# Altium schematic sheet MCU.SchDoc
size A; SheetNumber: 5; SheetTotal: 11
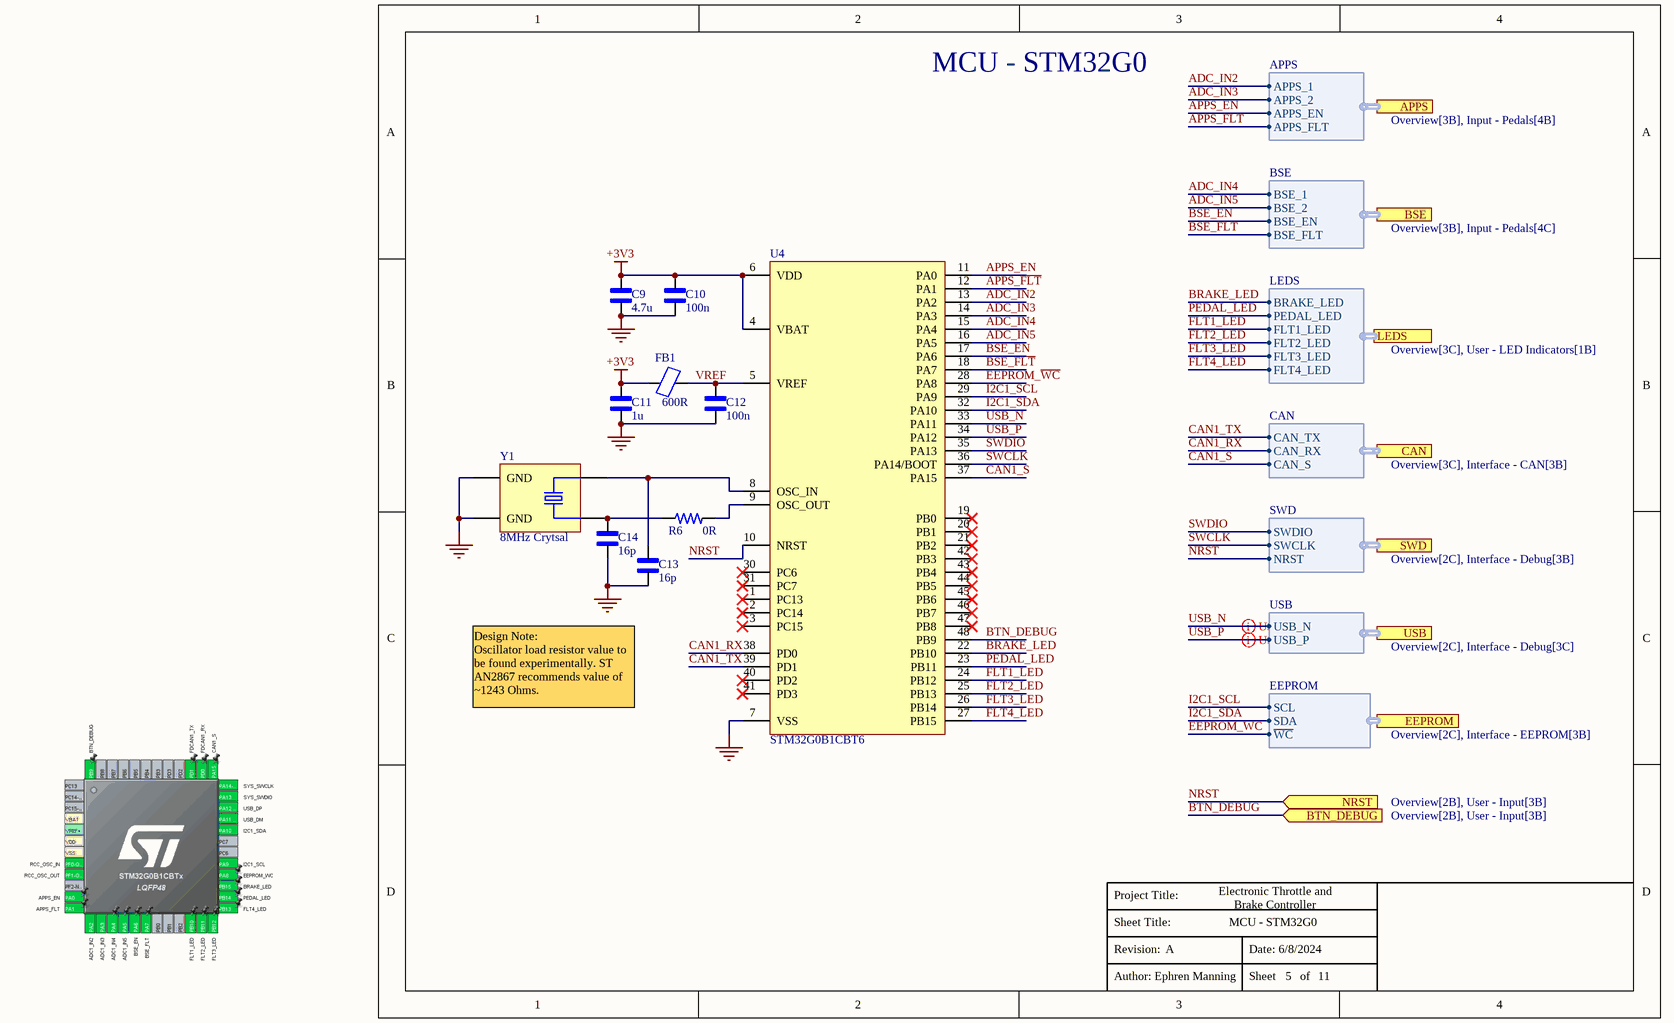
[diagram p0: MCU.SchDoc]

## Parts
C9  4.7u  [CAP_0402-Footprint-1]
C10  100n  [CAP_0402-Footprint-1]
C11  1u  [CAP_0402-Footprint-1]
C12  100n  [CAP_0402-Footprint-1]
C13  16p  [CAP_0402-Footprint-1]
C14  16p  [CAP_0402-Footprint-1]
FB1  600R  [FB_0402-Footprint-1]
R6  0R  [RES_0402-Footprint-1]
U4  STM32G0B1CBT6  [STM32G0-LQFP48]
Y1  ECS-80-18-33-JGN-TR  [XTAL_ECS-240-8-33-AGN-TR]  (value not drawn)

## Ports
APPS (harness APPS, see Overview[3B], Input - Pedals[4B]), BSE (harness BSE, see Overview[3B], Input - Pedals[4C]), BTN_DEBUG (in, see Overview[2B], User - Input[3B]), CAN (harness CAN, see Overview[3C], Interface - CAN[3B]), EEPROM (harness EEPROM, see Overview[2C], Interface - EEPROM[3B]), LEDS (harness LEDS, see Overview[3C], User - LED Indicators[1B]), NRST (in, see Overview[2B], User - Input[3B]), SWD (harness SWD, see Overview[2C], Interface - Debug[3B]), USB (harness USB, see Overview[2C], Interface - Debug[3C])

## Harnesses
CAN: CAN_TX, CAN_RX, CAN_S
SWD: SWDIO, SWCLK, NRST
USB: USB_N, USB_P
LEDS: BRAKE_LED, PEDAL_LED, FLT1_LED, FLT2_LED, FLT3_LED, FLT4_LED
EEPROM: SCL, SDA, ~{WC}
APPS: APPS_1, APPS_2, APPS_EN, APPS_FLT
BSE: BSE_1, BSE_2, BSE_EN, BSE_FLT

## Nets
+3V3: C9.2 C10.2 C11.2 FB1.1 U4.4(VBAT) U4.6(VDD)
GND: C9.1 C10.1 C11.1 C12.1 C13.2 C14.1 U4.7(VSS) Y1.2(GND) Y1.4(GND)
ADC_IN2: U4.13(PA2) ; port APPS.APPS_1
ADC_IN3: U4.14(PA3) ; port APPS.APPS_2
ADC_IN4: U4.15(PA4) ; port BSE.BSE_1
ADC_IN5: U4.16(PA5) ; port BSE.BSE_2
APPS_EN: U4.11(PA0) ; port APPS.APPS_EN
APPS_~{FLT}: U4.12(PA1) ; port APPS.APPS_FLT
BRAKE_LED: U4.22(PB10) ; port LEDS.BRAKE_LED
BSE_EN: U4.17(PA6) ; port BSE.BSE_EN
BSE_~{FLT}: U4.18(PA7) ; port BSE.BSE_FLT
BTN_DEBUG: U4.48(PB9) ; port BTN_DEBUG
CAN1_RX: U4.38(PD0) ; port CAN.CAN_RX
CAN1_S: U4.37(PA15) ; port CAN.CAN_S
CAN1_TX: U4.39(PD1) ; port CAN.CAN_TX
EEPROM_~{WC}: U4.28(PA8) ; port EEPROM.~{WC}
FLT1_LED: U4.24(PB12) ; port LEDS.FLT1_LED
FLT2_LED: U4.25(PB13) ; port LEDS.FLT2_LED
FLT3_LED: U4.26(PB14) ; port LEDS.FLT3_LED
FLT4_LED: U4.27(PB15) ; port LEDS.FLT4_LED
I2C1_SCL: U4.29(PA9) ; port EEPROM.SCL
I2C1_SDA: U4.32(PA10) ; port EEPROM.SDA
NRST: U4.10(NRST) ; port NRST, port SWD.NRST
PEDAL_LED: U4.23(PB11) ; port LEDS.PEDAL_LED
SWCLK: U4.36(PA14/BOOT) ; port SWD.SWCLK
SWDIO: U4.35(PA13) ; port SWD.SWDIO
USB_N: U4.33(PA11) ; port USB.USB_N
USB_P: U4.34(PA12) ; port USB.USB_P
VREF: C12.2 FB1.2 U4.5(VREF)
NetC13_1: C13.1 U4.8(OSC_IN) Y1.1(IN/OUT)
NetC14_2: C14.2 R6.1 Y1.3(OUT/IN)
NetR6_2: R6.2 U4.9(OSC_OUT)

Not connected (* = marked no-connect by the designer): U4 1(PC13)* 2(PC14)* 3(PC15)* 19(PB0)* 20(PB1)* 21(PB2)* 30(PC6)* 31(PC7)* 40(PD2)* 41(PD3)* 42(PB3)* 43(PB4)* 44(PB5)* 45(PB6)* 46(PB7)* 47(PB8)*

## Layout directives
differential pair: USB_N, USB_P

## Notes on the sheet
- MCU - STM32G0
- (near Y1) 8MHz Crytsal
- Design Note:
  Oscillator load resistor value to be found experimentally. ST AN2867 recommends value of ~1243 Ohms.
- Electronic Throttle and
  Brake Controller
- A
- 6/8/2024
- Ephren Manning
- 5
- 11
- Project Title:
- Sheet Title:
- Revision:
- Date:
- Author:
- Sheet        of

## Library data of the parts
C9 = CMP-00067-3: 4.7uF 10V 20% 0402 CAP; Manufacturer Part Number 1: CL05A475MP5NRNC; Manufacturer 1: Samsung Electro-Mechanics; Digikey Part Number: 1276-1482-1-ND
C10 C12 = CMP-00066-3: 100nF 10V 10% 0402 CAP; Manufacturer 1: Samsung Electro-Mechanics; Manufacturer Part Number 1: CL05B104KP5NNNC; Digikey Part Number: 1276-1002-1-ND
C11 = CMP-00068-3: 1uF 10V 10% 0402 CAP; Manufacturer Part Number 1: CL05A105KP5NNNC; Manufacturer 1: Samsung Electro-Mechanics; Digikey Part Number: 1276-1076-1-ND
C13 C14 = CMP-00065-1: 16pF 50V 1% 0402 Ceramic Capacitor; Manufacturer Part Number 1: GJM1555C1H160FB01J; Manufacturer 1: Murata Electronics; Digikey Part Number: 490-GJM1555C1H160FB01JCT-ND
FB1 = CMP-00069-1: 600R@100MHz 300mA 0402 Ferrite Bead; Manufacturer 1: Murata Electronics; Manufacturer Part Number 1: BLM15AG601SN1D; Digikey Part Number: 490-1006-1-ND
R6 = CMP-00070-1: 0 Ohm 1/16W 0402 Resistor; Manufacturer 1: YAGEO; Manufacturer Part Number 1: RC0402JR-070RL; Digikey Part Number: 311-0.0JRCT-ND
U4 = CMP-00062-7: 32-bit Cortex-M0+ MCU 48LQFP; Manufacturer 1: STMicroelectronics; Digikey Part Number: 497-STM32G0B1CBT6-ND; Manufacturer Part Number 1: STM32G0B1CBT6
Y1 = CMP-128-000000-3: 8MHz ±20ppm 18pF Crystal; Manufacturer 1: ECS Inc.; Digikey Part Number: 50-ECS-80-18-33-JGN-CT-ND; Manufacturer Part Number 1: ECS-80-18-33-JGN-TR